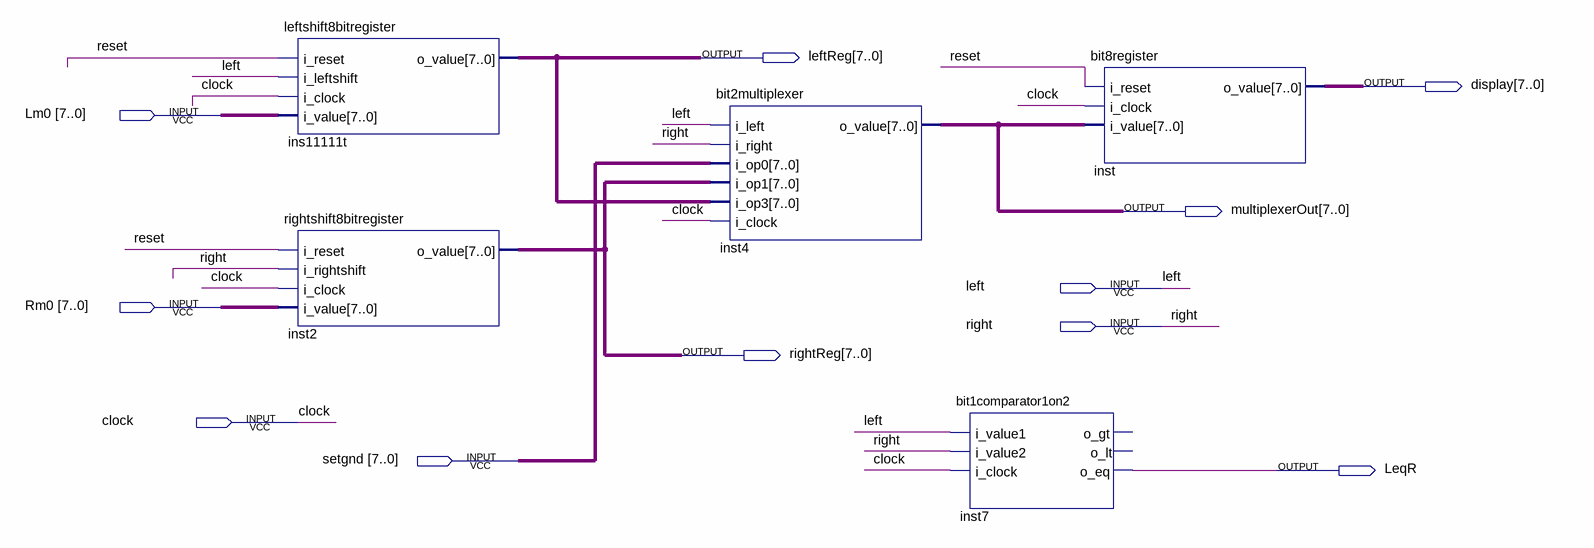
[diagram p0: schematic sheet]
// Quartus schematic Lab1.bdf as structural Verilog: 5 symbols, 11 pins
module Lab1 (
  input  [7:0] Lm0,
  input  left,
  input  [7:0] Rm0,
  input  right,
  input  clock,
  input  [7:0] setgnd,
  output [7:0] leftReg,
  output [7:0] display,
  output [7:0] multiplexerOut,
  output [7:0] rightReg,
  output LeqR
);

  wire reset;

  leftshift8bitregister ins11111t (
    .i_reset(reset), .i_leftshift(left), .i_clock(clock), .i_value(Lm0), .o_value(leftReg));
  rightshift8bitregister inst2 (
    .i_reset(reset), .i_rightshift(right), .i_clock(clock), .i_value(Rm0), .o_value(rightReg));
  bit2multiplexer inst4 (
    .i_left(left), .i_right(right), .i_op0(setgnd), .i_op1(rightReg), .i_op3(leftReg), .i_clock(clock),
    .o_value(multiplexerOut));
  bit1comparator1on2 inst7 (.i_value1(left), .i_value2(right), .i_clock(clock), .o_eq(LeqR));  // open: o_gt, o_lt
  bit8register inst (.i_reset(reset), .i_clock(clock), .i_value(multiplexerOut), .o_value(display));
endmodule
